# Altium schematic sheet LV2842.SchDoc: Power management
size A4; SheetNumber: 4; SheetTotal: 7
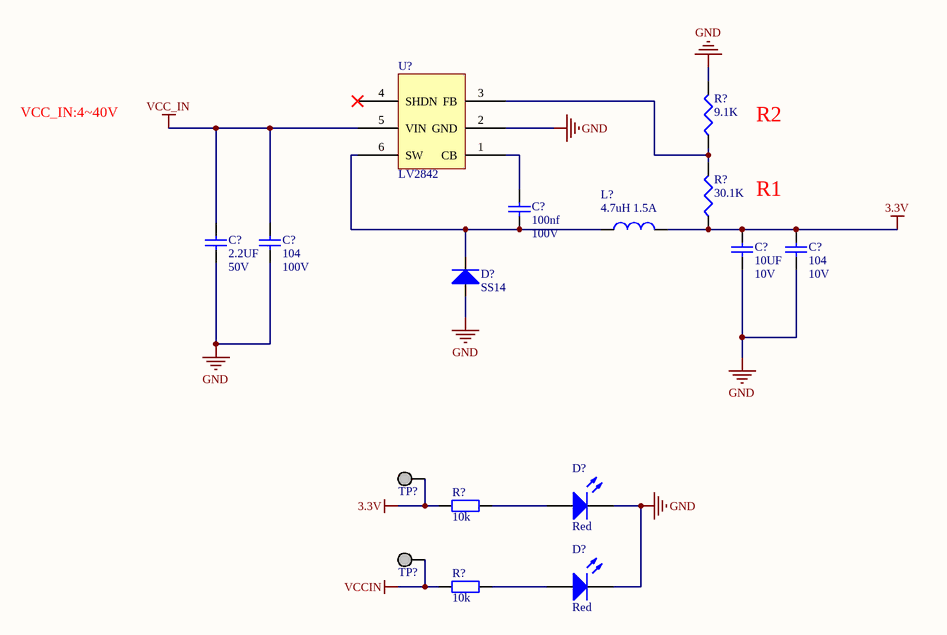
[diagram p0: LV2842.SchDoc]

## Parts
(Parts that share a designator on the sheet are numbered #1, #2 ... from top to bottom, then left to right.)
C?#1  100nf  Voltage Rating: 100V  [0603_C]
C?#2  2.2UF  Voltage Rating: 50V  [1206_C]
C?#3  104  Voltage Rating: 100V  [0603_C]
C?#4  10UF  Voltage Rating: 10V  [1206_C]
C?#5  104  Voltage Rating: 10V  [0603_C]
D?#1  SS14  [DO-214AC]
D?#2  value Red  [0805_LED]  (hidden comment: LED)
D?#3  value Red  [0805_LED]  (hidden comment: LED)
L?  4.7uH 1.5A  [1210_L]
R?#1  9.1K  [0603_R]
R?#2  30.1K  [0603_R]
R?#3  value 10k  [0603_R]  (hidden comment: Res)
R?#4  value 10k  [0603_R]  (hidden comment: Res)
TP?#1  TP  [TP_H]  (value not drawn)  (no BOM)
TP?#2  TP  [TP_H]  (value not drawn)  (no BOM)
U?  LV2842  [LC-TSOT-23-6]

## Nets
3.3V: C?#4.2 C?#5.2 L?.2 R?#2.1 R?#3.2 TP?#1.1
GND: C?#2.1 C?#3.1 C?#4.1 C?#5.1 D?#1.1(A) D?#2.2(K) D?#3.2(K) R?#1.2 U?.2(GND)
VCC_IN: C?#2.2 C?#3.2 U?.5(VIN)
VCCIN: R?#4.2 TP?#2.1
NetC?#1_1: C?#1.1 U?.1(CB)
NetC?#1_2: C?#1.2 D?#1.2(K) L?.1 U?.6(SW)
NetD?#2_1: D?#2.1(A) R?#3.1
NetD?#3_1: D?#3.1(A) R?#4.1
NetR?#1_1: R?#1.1 R?#2.2 U?.3(FB)

Not connected (* = marked no-connect by the designer): U? 4(SHDN)*

## Notes on the sheet
- VCC_IN:4~40V
- (near R?#1) R2
- (near C?#4) R1
- Title
- Size:
- Date:
- A4
- Number:
- Time:
- Revision:
- Sheet
- of
- File:

## Library data of the parts
C?#1-C?#5 = 1uF/1206/CER/100V: Capacitor, 1uF, 100V, X7R; Capacitance Tolerance: ± 10%; Capacitor Case Style: 1206; Brand Number: 12061C105K4Z2A; Brand: AVX; Dielectric Characteristic: X7R; Capacitance: 1uF; Temperature Range: -55°C to +125°C; Price: 0,52; Order Code Supplier: 1833855; Supplier: Farnell
D?#1 = MMSD4148T1G: Diode, Vrrm: 100V, If: 0.15A, Vf: 1V; Brand: ON SEMICONDUCTOR; Case Style: SOD-123; Forward Current: 0.2A; Price: 0,19; Brand Number: MMSD4148T1G; Order Code Supplier: 9556079; Supplier: Farnell; Temperature Range: -65°C to +150°C; Vrrm: 100V; Forward Voltage: 1V
D?#2 D?#3 = T_LED_Red_0805: 红色LED灯; Solder: SMD; Schematic Path: X:\Database\Schematic Library.Schlib; Part Number: T_LED_Red_0805; LibRef: T_LED_Red_0805
L? = 744043151: 150UH, 30%, 0.42A; Brand: Wurth; Case Style: WE-TPC 4828; DC Resistance: 0.770ohm; Brand Number: 744043151; DC Current: 0.42A; Inductance: 150uH; Order Code Supplier: 2082517; Price: 1,36; Q Factor: *; Supplier: Farnell; Temperature Range: -40°C to +125°C
R?#1 R?#2 = 4.7M/0805/0250W/150V: Resistor, 4.7M, 1%, 0.25W, 150V, 100PPM, 0805; Brand: MULTICOMP; Brand Number: MCHP05W4F4704T5E; Case Style: 0805; Order Code Supplier: 1576516; Power Rating: 0.25W; Price: 0,089; Resistance: 4.7M; Supplier: Farnell; Temperature Coefficient: ± 100PPM; Temperature Range: -55°C to +155°C; Voltage Rating: 150V
R?#3 R?#4 = T_Res_0603_10k_1%_1/10W: 贴片电阻; Solder: SMD; Power: 1/10W; Tolerance: 1%; Schematic Path: X:\Database\Schematic Library.Schlib; Part Number: T_Res_0603_10k_1%_1/10W; LibRef: T_Res_0603_10k_1%_1/10W
TP?#1 TP?#2 = T_TestPoint_H: 测试点_过孔; Solder: DIP; Schematic Path: X:\Database\Schematic Library.Schlib; Part Number: T_TestPoint_H; LibRef: T_TestPoint_H